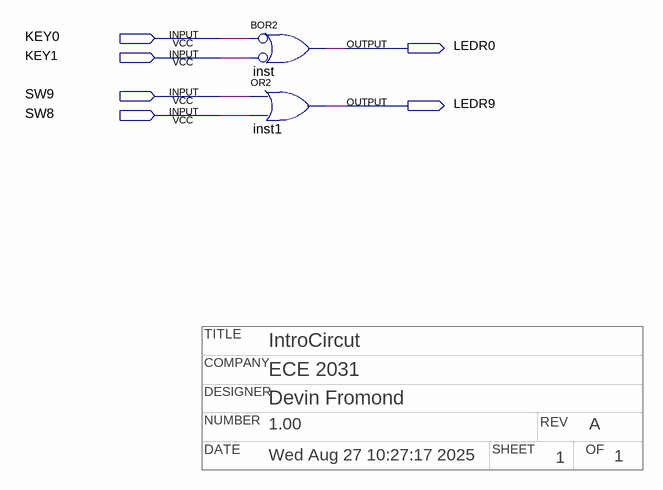
[diagram p0: schematic sheet]
// Quartus schematic IntroCircuit.bdf as structural Verilog: 2 symbols, 6 pins
// Title block: COMPANY: ECE 2031; DATE: Wed Aug 27 10:27:17 2025; DESIGNER: Devin Fromond; NUMBER: 1.00; OF: 1; REV: A; SHEET: 1; TITLE: IntroCircut
module IntroCircuit (
  input  KEY0,
  input  KEY1,
  input  SW9,
  input  SW8,
  output LEDR0,
  output LEDR9
);

  or inst (LEDR0, ~KEY0, ~KEY1);  // BOR2
  or inst1 (LEDR9, SW9, SW8);
endmodule
